# EAGLE design Link_Infinite_Thick (EAGLE 9.6.2)
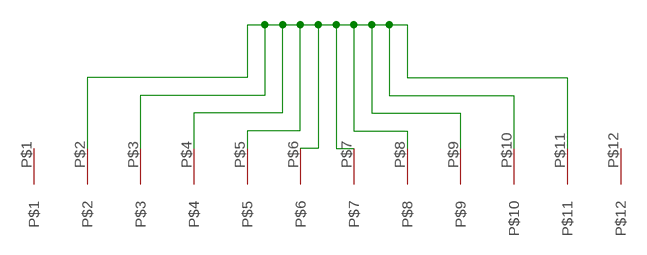
[diagram p0: schematic, sheet 1]

## Parts
U$1  BEAST  [BEAST]

## Nets
N$2: U$1.P$2 U$1.P$3 U$1.P$4 U$1.P$5 U$1.P$6 U$1.P$7 U$1.P$8 U$1.P$9 U$1.P$10 U$1.P$11
Unconnected: U$1.P$1 U$1.P$12

## Library data of the parts
U$1 = beastpins:BEAST

## Board
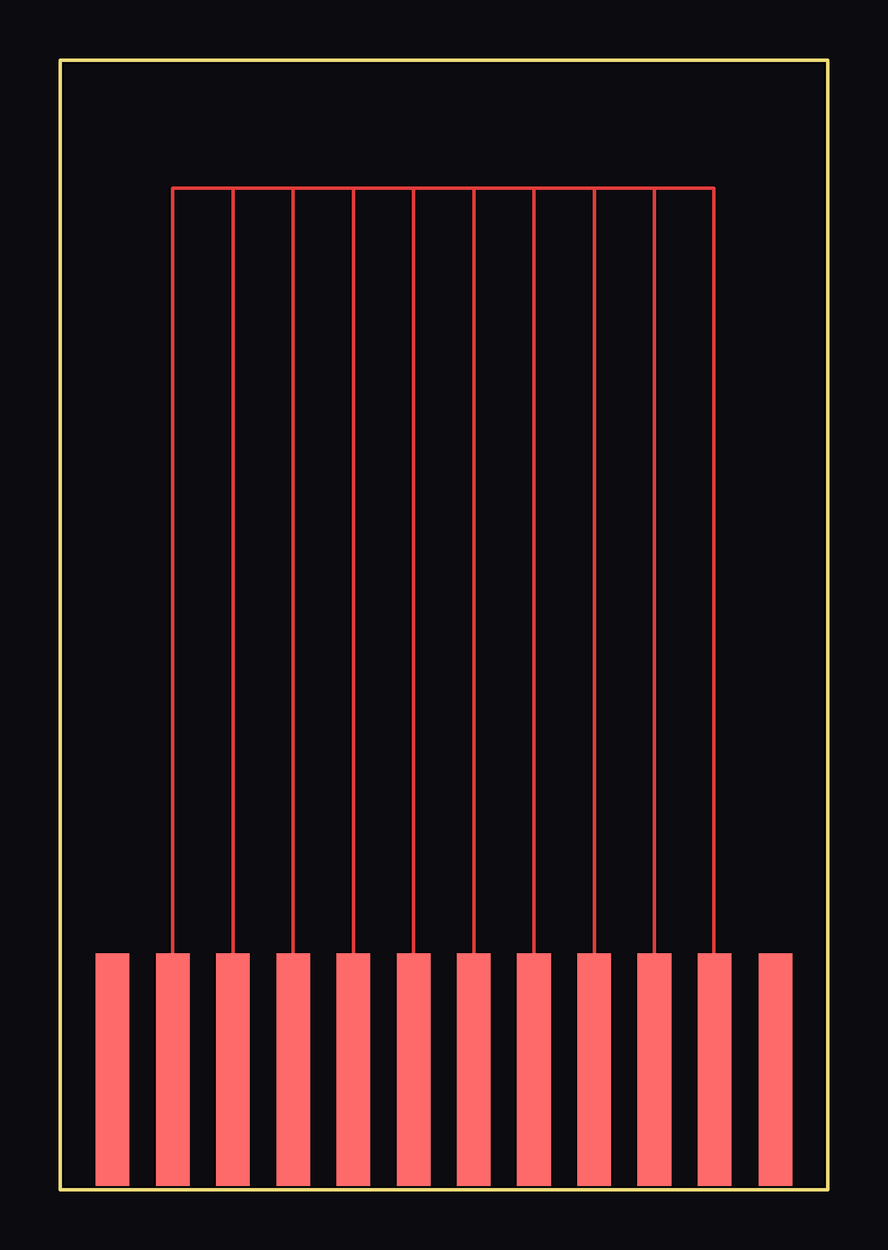
[diagram p1: board, top side]

Size 32 x 47.1 mm. Coordinates in mm from the lower left corner, seen from the top.
Outline: 0,47.1 32,47.1
Outline: 0,47 0,0 32,0 32,47
Copper layers (1*16): Top 0.035mm / dielectric 1.5mm / Bottom 0.035mm
Design rules "default": minimum track width 6mil, minimum drill 0.35mm, track to track 6mil, track to pad 6mil, pad to pad 6mil, via to via 6mil, smd to smd 6mil, copper to edge 40mil, drill to drill 6mil, minimum pad ring 10mil, minimum via ring 8mil, stop-mask expansion 4mil, vias tented up to drill 0mil, thermal gap 10mil

### Footprints (pad centres in the part's own frame; a part is rotated, then mirrored left to right if it is on the bottom)
BEAST = smd 1.4 x 9.7: P$1 -27.61,5.02; P$2 -25.1,5.02; P$3 -22.59,5.02; P$4 -20.08,5.02; P$5 -17.57,5.02; P$6 -15.06,5.02; P$7 -12.55,5.02; P$8 -10.04,5.02; P$9 -7.53,5.02; P$10 -5.02,5.02; P$11 -2.51,5.02; P$12 0.03,5.02

### Placement (x,y rotation side)
U$1  29.8,0 0 top

### Tracks (layer width: path | path; a pad name or v marks a point on that pad's centre or on a via)
N$2
  Top 0.152: U$1.P$2 4.7,41.75 7.2,41.75 | 7.2,41.75 9.75,41.75 | 9.75,41.75 12.3,41.75 | 12.3,41.75 14.75,41.75 | 14.75,41.75 17.3,41.75 | 17.3,41.75 19.8,41.75 | 19.8,41.75 22.25,41.75 | 22.25,41.75 24.85,41.75 | 24.85,41.75 27.25,41.75 27.25,9.9 27.25,6.9 27.25,5.06 U$1.P$11 | U$1.P$3 7.21,41.74 7.2,41.75 | U$1.P$4 9.72,41.72 9.75,41.75 | U$1.P$5 12.23,41.68 12.3,41.75 | U$1.P$6 14.74,41.74 14.75,41.75 | U$1.P$7 17.25,41.7 17.3,41.75 | U$1.P$8 19.76,41.71 19.8,41.75 | U$1.P$9 22.27,41.73 22.25,41.75 | 24.85,41.75 24.78,41.68 U$1.P$10